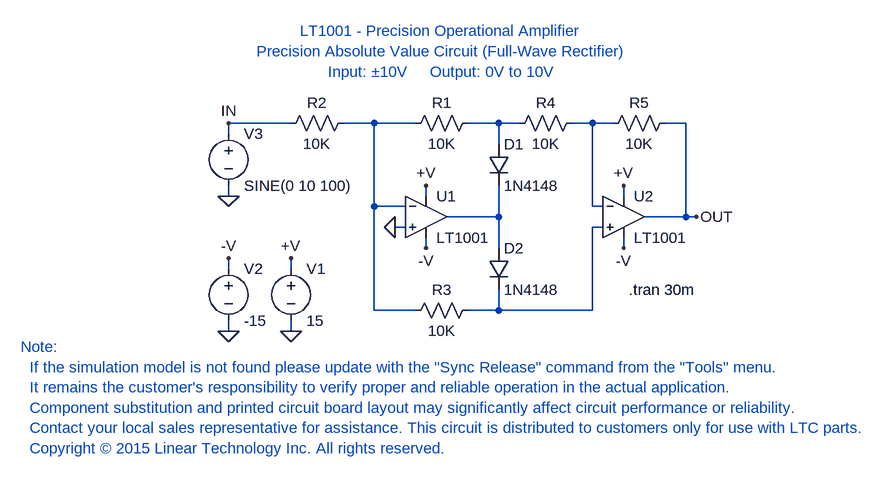
[diagram p0: schematic LT1001_TA10.asc]
LT1001_TA10.asc, the LTspice schematic file:
Version 4
SHEET 1 1240 680
WIRE 0 96 -96 96
WIRE 128 96 80 96
WIRE 192 96 128 96
WIRE 320 96 272 96
WIRE 352 96 320 96
WIRE 464 96 432 96
WIRE 496 96 464 96
WIRE 608 96 576 96
WIRE -96 112 -96 96
WIRE 320 128 320 96
WIRE -96 208 -96 192
WIRE 208 208 208 192
WIRE 512 208 512 192
WIRE 128 224 128 96
WIRE 176 224 128 224
WIRE 464 224 464 96
WIRE 480 224 464 224
WIRE 320 240 320 192
WIRE 320 240 240 240
WIRE 608 240 608 96
WIRE 608 240 544 240
WIRE 624 240 608 240
WIRE 176 256 160 256
WIRE 480 256 464 256
WIRE 208 288 208 272
WIRE 320 288 320 240
WIRE 512 288 512 272
WIRE -96 320 -96 304
WIRE 0 320 0 304
WIRE 128 384 128 224
WIRE 192 384 128 384
WIRE 320 384 320 352
WIRE 320 384 272 384
WIRE 464 384 464 256
WIRE 464 384 320 384
WIRE -96 416 -96 400
WIRE 0 416 0 400
FLAG 0 416 0
FLAG 208 192 +V
FLAG 0 304 +V
FLAG 208 288 -V
FLAG -96 416 0
FLAG -96 304 -V
FLAG -96 208 0
FLAG 512 192 +V
FLAG 512 288 -V
FLAG 160 256 0
FLAG -96 96 IN
FLAG 624 240 OUT
SYMBOL voltage 0 304 R0
SYMATTR InstName V1
SYMATTR Value 15
SYMBOL LT1001 208 176 R0
SYMATTR InstName U1
SYMBOL voltage -96 304 R0
SYMATTR InstName V2
SYMATTR Value -15
SYMBOL res 288 80 R90
WINDOW 0 0 56 VBottom 2
WINDOW 3 32 56 VTop 2
SYMATTR InstName R1
SYMATTR Value 10K
SYMBOL voltage -96 96 R0
WINDOW 123 0 0 Left 2
WINDOW 39 0 0 Left 2
SYMATTR InstName V3
SYMATTR Value SINE(0 10 100)
SYMBOL LT1001 512 176 R0
SYMATTR InstName U2
SYMBOL diode 304 128 R0
SYMATTR InstName D1
SYMATTR Value 1N4148
SYMBOL res 96 80 R90
WINDOW 0 0 56 VBottom 2
WINDOW 3 32 56 VTop 2
SYMATTR InstName R2
SYMATTR Value 10K
SYMBOL res 288 368 R90
WINDOW 0 0 56 VBottom 2
WINDOW 3 32 56 VTop 2
SYMATTR InstName R3
SYMATTR Value 10K
SYMBOL res 448 80 R90
WINDOW 0 0 56 VBottom 2
WINDOW 3 32 56 VTop 2
SYMATTR InstName R4
SYMATTR Value 10K
SYMBOL res 592 80 R90
WINDOW 0 0 56 VBottom 2
WINDOW 3 32 56 VTop 2
SYMATTR InstName R5
SYMATTR Value 10K
SYMBOL diode 304 288 R0
SYMATTR InstName D2
SYMATTR Value 1N4148
TEXT 520 352 Left 2 !.tran 30m
TEXT 232 32 Bottom 2 ;LT1001 - Precision Operational Amplifier\nPrecision Absolute Value Circuit (Full-Wave Rectifier)\nInput: ±10V     Output: 0V to 10V
TEXT -416 440 Left 2 ;Note:\n  If the simulation model is not found please update with the "Sync Release" command from the "Tools" menu.\n  It remains the customer's responsibility to verify proper and reliable operation in the actual application.\n  Component substitution and printed circuit board layout may significantly affect circuit performance or reliability.\n  Contact your local sales representative for assistance. This circuit is distributed to customers only for use with LTC parts.\n  Copyright © 2015 Linear Technology Inc. All rights reserved.

The netlist it stands for:
* LT1001_TA10.asc
V1 +V 0 15
XU1 0 N001 +V -V N004 LT1001  ; pins In+ In- V+ V- OUT
V2 -V 0 -15
R1 N002 N001 10K
V3 IN 0 SINE(0 10 100)
XU2 N005 N003 +V -V OUT LT1001  ; pins In+ In- V+ V- OUT
D1 N002 N004 1N4148
R2 N001 IN 10K
R3 N005 N001 10K
R4 N003 N002 10K
R5 OUT N003 10K
D2 N004 N005 1N4148
.model D D
.lib standard.dio
.tran 30m
* LT1001 - Precision Operational Amplifier
* Precision Absolute Value Circuit (Full-Wave Rectifier)
* Input: ±10V     Output: 0V to 10V
* Note:
*   If the simulation model is not found please update with the "Sync Release" command from the "Tools" menu.
*   It remains the customer's responsibility to verify proper and reliable operation in the actual application.
*   Component substitution and printed circuit board layout may significantly affect circuit performance or reliability.
*   Contact your local sales representative for assistance. This circuit is distributed to customers only for use with LTC parts.
*   Copyright © 2015 Linear Technology Inc. All rights reserved.
.lib LTC.lib
.backanno
.end